# Altium schematic sheet 四路12V30A无线遥控控制板.SchDoc
size A4
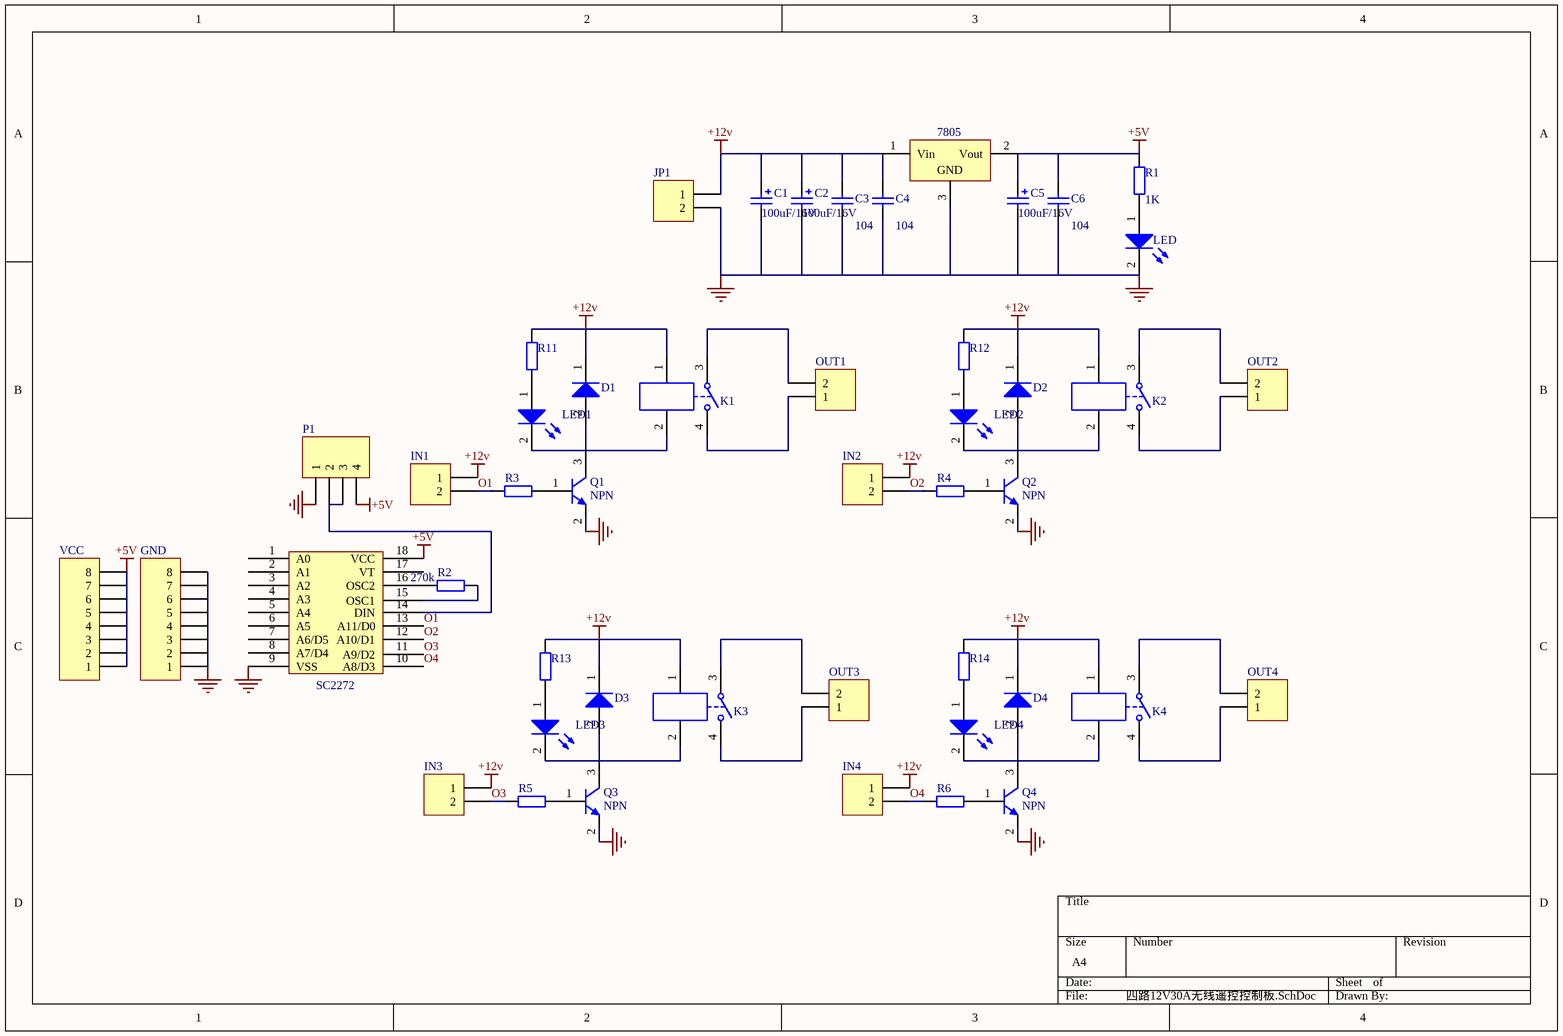
[diagram p0: 四路12V30A无线遥控控制板.SchDoc]

## Parts
7805  SDWYG  [78XX]  (value not drawn)
C1  value 100uF/16V  [C-DJ-6]  (hidden comment: DJDR)
C2  value 100uF/16V  [C-DJ-6]  (hidden comment: DJDR)
C3  value 104  [CPDR]  (hidden comment: CPDR)
C4  value 104  [CPDR]  (hidden comment: CPDR)
C5  value 100uF/16V  [C-DJ-6]  (hidden comment: DJDR)
C6  value 104  [CPDR]  (hidden comment: CPDR)
D1  ZL2JG  [7227]  (value not drawn)
D2  ZL2JG  [7227]  (value not drawn)
D3  ZL2JG  [7227]  (value not drawn)
D4  ZL2JG  [7227]  (value not drawn)
DS1  LED  [LED_D]
GND  Header 8  [P8]  (value not drawn)
IN1  PZ_2  [HDR-2]  (value not drawn)
IN2  PZ_2  [HDR-2]  (value not drawn)
IN3  PZ_2  [HDR-2]  (value not drawn)
IN4  PZ_2  [HDR-2]  (value not drawn)
JP1  PZ_2  [KF8500-2]  (value not drawn)
K1  JDQ1K  [SLA-12VDC-SL-A]  (value not drawn)
K2  JDQ1K  [SLA-12VDC-SL-A]  (value not drawn)
K3  JDQ1K  [SLA-12VDC-SL-A]  (value not drawn)
K4  JDQ1K  [SLA-12VDC-SL-A]  (value not drawn)
LED1  (no value)  [LED_D]
LED2  (no value)  [LED_D]
LED3  (no value)  [LED_D]
LED4  (no value)  [LED_D]
OUT1  PZ_2  [KF8500-2]  (value not drawn)
OUT2  PZ_2  [KF8500-2]  (value not drawn)
OUT3  PZ_2  [KF8500-2]  (value not drawn)
OUT4  PZ_2  [KF8500-2]  (value not drawn)
P1  Header 4  [HDR1X4]  (value not drawn)
Q1  NPN  [SO-G3]
Q2  NPN  [SO-G3]
Q3  NPN  [SO-G3]
Q4  NPN  [SO-G3]
R1  value 1K  [TP-0805-R]  (hidden comment: Res)
R2  value 270k  [TP-0805-R]  (hidden comment: Res2)
R3  Res  [TP-0805-R]  (value not drawn)
R4  Res  [TP-0805-R]  (value not drawn)
R5  Res  [TP-0805-R]  (value not drawn)
R6  Res  [TP-0805-R]  (value not drawn)
R11  Res  [TP-0805-R]  (value not drawn)
R12  Res  [TP-0805-R]  (value not drawn)
R13  Res  [TP-0805-R]  (value not drawn)
R14  Res  [TP-0805-R]  (value not drawn)
SC2272  SC2272  [DIP18]  (value not drawn)
VCC  Header 8  [P8]  (value not drawn)

## Nets
+5V: 7805.2(Vout) C5.1 C6.2 P1.4 R1.2 SC2272.18(VCC) VCC.1 VCC.2 VCC.3 VCC.4 VCC.5 VCC.6 VCC.7 VCC.8
+12v: 7805.1(Vin) C1.1 C2.1 C3.2 C4.2 D1.1(K) D2.1(K) D3.1(K) D4.1(K) IN1.1 IN2.1 IN3.1 IN4.1 JP1.1 K1.1 K2.1 K3.1 K4.1 R11.2 R12.2 R13.2 R14.2
GND: 7805.3(GND) C1.2 C2.2 C3.1 C4.1 C5.2 C6.1 DS1.2(K) GND.1 GND.2 GND.3 GND.4 GND.5 GND.6 GND.7 GND.8 JP1.2 P1.1 Q1.2(E) Q2.2(E) Q3.2(E) Q4.2(E) SC2272.9(VSS)
O1: IN1.2 R3.2 SC2272.13(A11/D0)
O2: IN2.2 R4.2 SC2272.12(A10/D1)
O3: IN3.2 R5.2 SC2272.11(A9/D2)
O4: IN4.2 R6.2 SC2272.10(A8/D3)
NetD1_2: D1.2(A) K1.2 LED1.2(K) Q1.3(C)
NetD2_2: D2.2(A) K2.2 LED2.2(K) Q2.3(C)
NetD3_2: D3.2(A) K3.2 LED3.2(K) Q3.3(C)
NetD4_2: D4.2(A) K4.2 LED4.2(K) Q4.3(C)
NetDS1_1: DS1.1(A) R1.1
NetK1_3: K1.3 OUT1.2
NetK1_4: K1.4 OUT1.1
NetK2_3: K2.3 OUT2.2
NetK2_4: K2.4 OUT2.1
NetK3_3: K3.3 OUT3.2
NetK3_4: K3.4 OUT3.1
NetK4_3: K4.3 OUT4.2
NetK4_4: K4.4 OUT4.1
NetLED1_1: LED1.1(A) R11.1
NetLED2_1: LED2.1(A) R12.1
NetLED3_1: LED3.1(A) R13.1
NetLED4_1: LED4.1(A) R14.1
NetP1_2: P1.2 P1.3 SC2272.14(DIN)
NetQ1_1: Q1.1(B) R3.1
NetQ2_1: Q2.1(B) R4.1
NetQ3_1: Q3.1(B) R5.1
NetQ4_1: Q4.1(B) R6.1
NetR2_1: R2.1 SC2272.16(OSC2)
NetR2_2: R2.2 SC2272.15(OSC1)

Not connected (* = marked no-connect by the designer): SC2272 1(A0) 2(A1) 3(A2) 4(A3) 5(A4) 6(A5) 7(A6/D5) 8(A7/D4) 17(VT)

## Library data of the parts
7805 = SDWYG: 三端稳压器; Published: 24-Mar-1999; LatestRevisionDate: 17-Jul-2002; LatestRevisionNote: Re-released for DXP Platform.; Publisher: Altium Limited; Code_JEDEC: SMD-220
C1 C2 C5 = DJDR: 电解电容; Published: 8-Jun-2000; LatestRevisionDate: 17-Jul-2002; LatestRevisionNote: Re-released for DXP Platform.; Publisher: Altium Limited
C3 C4 C6 = CPDR: 瓷片电容; Published: 8-Jun-2000; LatestRevisionDate: 17-Jul-2002; LatestRevisionNote: Re-released for DXP Platform.; Publisher: Altium Limited
D1-D4 = ZL2JG: 整流二极管; Published: 8-Jun-2000; LatestRevisionDate: 17-Jul-2002; LatestRevisionNote: Re-released for DXP Platform.; DatasheetDocument: 1998; PackageDocument: Aug-1999; PackageReference: DO-201AD; Publisher: Altium Limited
DS1 LED1-LED4 = LED: 发光二极管; Published: 8-Jun-2000; LatestRevisionDate: 17-Jul-2002; LatestRevisionNote: Re-released for DXP Platform.; Publisher: Altium Limited
GND VCC = Header 8: Header, 8-Pin; LatestRevisionDate: 17-Jul-2002; LatestRevisionNote: Re-released for DXP Platform.; Publisher: Altium Limited
IN1-IN4 JP1 OUT1-OUT4 = PZ_2: 排针——2; LatestRevisionDate: 17-Jul-2002; LatestRevisionNote: Re-released for DXP Platform.; Publisher: Altium Limited
K1-K4 = JDQ1K: 继电器一常开
P1 = Header 4: Header, 4-Pin; LatestRevisionDate: 17-Jul-2002; LatestRevisionNote: Re-released for DXP Platform.; Publisher: Altium Limited
Q1-Q4 = NPN: NPN Bipolar Transistor; Published: 8-Jun-2000; LatestRevisionDate: 17-Jul-2002; LatestRevisionNote: Re-released for DXP Platform.; Publisher: Altium Limited; Code_JEDEC: TO-226-AA
R1 = Res: 电阻; Published: 8-Jun-2000; LatestRevisionDate: 17-Jul-2002; LatestRevisionNote: Re-released for DXP Platform.; Publisher: Altium Limited
R2 = Res2: Resistor; Published: 8-Jun-2000; LatestRevisionDate: 17-Jul-2002; LatestRevisionNote: Re-released for DXP Platform.; Publisher: Altium Limited
R3-R6 R11-R14 = Res: 电阻; Value: 1K; Published: 8-Jun-2000; LatestRevisionDate: 17-Jul-2002; LatestRevisionNote: Re-released for DXP Platform.; Publisher: Altium Limited
SC2272 = SC2272: 无线接收芯片